# Altium schematic sheet CHM_CPU_FPGA_ADC.SchDoc: ASIM MXGS PSU Controller
size A4; Author: Andrzej Cichocki; Organization: Space Research Centre; Address1: Bartycka 18a; Address2: 00-716 Warsaw; Address3: Poland; Revision: 1; ModuleName: MainBoard Main; SubOrganization1: FPGA Space Applications Lab.
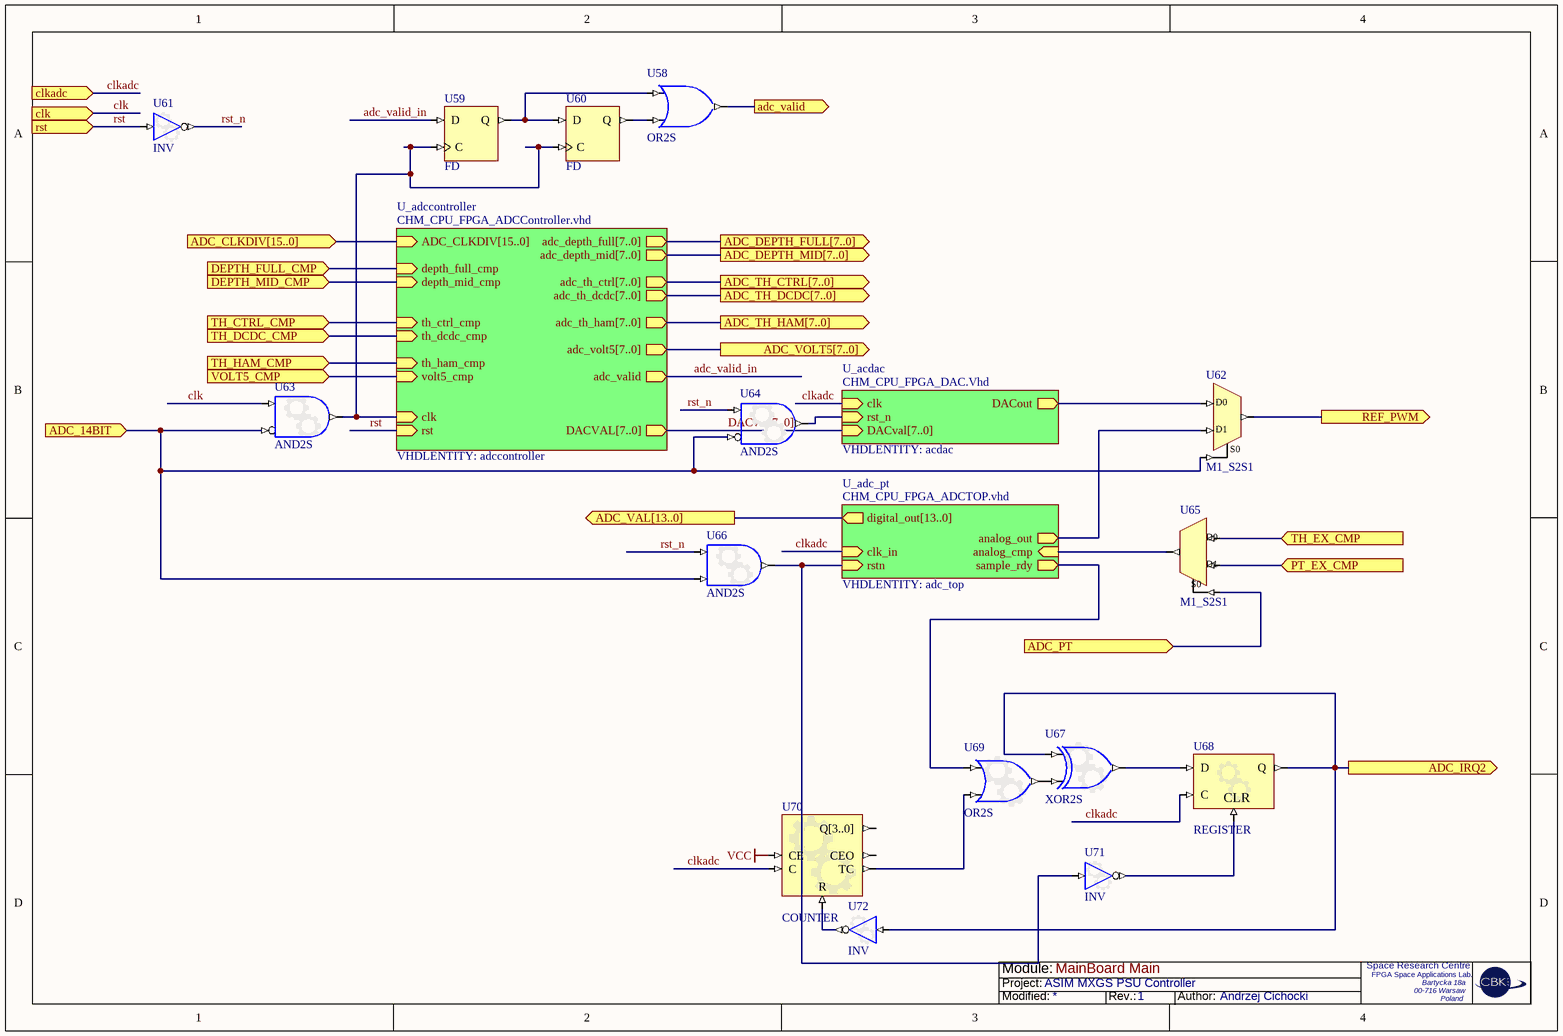
[diagram p0: CHM_CPU_FPGA_ADC.SchDoc]

## Parts
U58  OR2S
U59  FD
U60  FD
U61  INV
U62  M1_S2S1
U63  AND2S
U64  AND2S
U65  M1_S2S1
U66  AND2S
U67  XOR2S
U68  REGISTER
U69  OR2S
U70  COUNTER
U71  INV
U72  INV

## Sub-sheets
U_acdac = CHM_CPU_FPGA_DAC.Vhd: clk (in), DACout (out), rst_n (in), DACval[7..0] (in)  | VHDLENTITY: acdac
U_adc_pt = CHM_CPU_FPGA_ADCTOP.vhd: analog_cmp (in), analog_out (out), clk_in (in), rstn (in), sample_rdy (out), digital_out[13..0] (out)  | VHDLENTITY: adc_top
U_adccontroller = CHM_CPU_FPGA_ADCController.vhd: ADC_CLKDIV[15..0] (in), adc_depth_full[7..0] (out), adc_depth_mid[7..0] (out), adc_th_ctrl[7..0] (out), adc_th_dcdc[7..0] (out), adc_th_ham[7..0] (out), adc_valid (out), adc_volt5[7..0] (out), clk (in), depth_full_cmp (in), depth_mid_cmp (in), rst (in), th_ctrl_cmp (in), th_dcdc_cmp (in), th_ham_cmp (in), volt5_cmp (in), DACVAL[7..0] (out)  | VHDLENTITY: adccontroller

## Ports
ADC_14BIT (in), ADC_CLKDIV[15..0] (in), ADC_DEPTH_FULL[7..0] (out), ADC_DEPTH_MID[7..0] (out), ADC_IRQ2 (out), ADC_PT (in), ADC_TH_CTRL[7..0] (out), ADC_TH_DCDC[7..0] (out), ADC_TH_HAM[7..0] (out), ADC_VAL[13..0] (out), adc_valid (out), ADC_VOLT5[7..0] (out), clk (in), clkadc (in), DEPTH_FULL_CMP (in), DEPTH_MID_CMP (in), PT_EX_CMP (in), REF_PWM (out), rst (in), TH_CTRL_CMP (in), TH_DCDC_CMP (in), TH_EX_CMP (in), TH_HAM_CMP (in), VOLT5_CMP (in)

## Nets
VCC: U70.CE
ADC_14BIT: U62.S0 U63.I1 U64.I1 U66.I1 ; port ADC_14BIT
ADC_IRQ2: U67.I0 U68.Q U72.I ; port ADC_IRQ2
ADC_PT: U65.S0 ; port ADC_PT
adc_valid: U58.O ; port adc_valid
adc_valid_in: U59.D ; sheet U_adccontroller/adc_valid
clk: U63.I0 ; port clk
clkadc: U68.C U70.C ; port clkadc, sheet U_acdac/clk, sheet U_adc_pt/clk_in
DEPTH_FULL_CMP: port DEPTH_FULL_CMP, sheet U_adccontroller/depth_full_cmp
DEPTH_MID_CMP: port DEPTH_MID_CMP, sheet U_adccontroller/depth_mid_cmp
PT_EX_CMP: U65.D1 ; port PT_EX_CMP
REF_PWM: U62.O ; port REF_PWM
rst: U61.I ; port rst, sheet U_adccontroller/rst
rst_n: U61.O U64.I0 U66.I0
TH_CTRL_CMP: port TH_CTRL_CMP, sheet U_adccontroller/th_ctrl_cmp
TH_DCDC_CMP: port TH_DCDC_CMP, sheet U_adccontroller/th_dcdc_cmp
TH_EX_CMP: U65.D0 ; port TH_EX_CMP
TH_HAM_CMP: port TH_HAM_CMP, sheet U_adccontroller/th_ham_cmp
VOLT5_CMP: port VOLT5_CMP, sheet U_adccontroller/volt5_cmp
NetU58_I0: U58.I0 U59.Q U60.D
NetU58_I1: U58.I1 U60.Q
NetU59_C: U59.C U60.C U63.O ; sheet U_adccontroller/clk
NetU62_D0: U62.D0 ; sheet U_acdac/DACout
NetU62_D1: U62.D1 ; sheet U_adc_pt/analog_out
NetU64_O: U64.O ; sheet U_acdac/rst_n
NetU65_O: U65.O ; sheet U_adc_pt/analog_cmp
NetU66_O: U66.O U71.I ; sheet U_adc_pt/rstn
NetU67_I1: U67.I1 U69.O
NetU67_O: U67.O U68.D
NetU68_CLR: U68.CLR U71.O
NetU69_I0: U69.I0 ; sheet U_adc_pt/sample_rdy
NetU69_I1: U69.I1 U70.TC
NetU70_R: U70.R U72.O

Not connected (* = marked no-connect by the designer): U70 CEO Q[3..0]

## Buses and harness runs
bus DACval[7..0] = sheet U_acdac/DACval[7..0] = sheet U_adccontroller/DACVAL[7..0]
bus port ADC_CLKDIV[15..0] = sheet U_adccontroller/ADC_CLKDIV[15..0]
bus port ADC_DEPTH_FULL[7..0] = sheet U_adccontroller/adc_depth_full[7..0]
bus port ADC_DEPTH_MID[7..0] = sheet U_adccontroller/adc_depth_mid[7..0]
bus port ADC_TH_CTRL[7..0] = sheet U_adccontroller/adc_th_ctrl[7..0]
bus port ADC_TH_DCDC[7..0] = sheet U_adccontroller/adc_th_dcdc[7..0]
bus port ADC_TH_HAM[7..0] = sheet U_adccontroller/adc_th_ham[7..0]
bus port ADC_VAL[13..0] = sheet U_adc_pt/digital_out[13..0]
bus port ADC_VOLT5[7..0] = sheet U_adccontroller/adc_volt5[7..0]

## Notes on the sheet
- Module:
- Project:
- Modified:
- Rev.:
- Author:

## Library data of the parts
U58 = OR2S: 2-Input OR Gate, Single Pin Version; XilinxEquivalent: OR2; FunctionalClass: Logic Primitive; PortSize: 2; ArchiveName: GENERIC; VHDLIB_SIM: GENERIC_LIB; Published: 29-Jan-2004; Publisher: Altium Limited; LastRevisionNo: 1.00.00; HelpURL: CR0118 FPGA Generic Library Guide.pdf#page=410; ComponentLink1URL: CR0136 FPGA Logic Primitive Resource Usage.pdf#page=190; ComponentLink1Description: Core &Resource Usage; SubClass: OR; PortStyle: Single Pin Version
U59 U60 = FD: D-Type Flip-Flop; ClockTrigger: Rising; ArchiveName: GENERIC; VHDLIB_SIM: GENERIC_LIB; Published: 29-Jan-2004; Publisher: Altium Limited; XilinxEquivalent: FD; LastRevisionNo: 1.00.00; HelpURL: CR0118 FPGA Generic Library Guide.pdf#page=170; ComponentLink1URL: CR0133 FPGA Flip Flop Resource Usage.pdf#page=4; ComponentLink1Description: Core &Resource Usage; FunctionalClass: Flip-Flop; SubClass: FD
U61 U71 U72 = INV: Configurable Inverter; ConfigurationParameters: {}Version[1.1]{}SignalCount[1]{}SignalWidth0[1]{}OutputOption0[Inverted]{}EnableMode[None]{}ShowPinNames[False]{}; ConfiguratorName: GENERIC_BUFFER; LastRevisionNo: 1.00.00; Published: 10-Oct-2008; Publisher: Altium Limited; HelpURL: https://wiki.altium.com/display/ADOH/Configurable+Generic+Library
U62 U65 = M1_S2S1: 2x1-Single Wire to 1x1-Single Wire Multiplexer; XilinxEquivalent: M2_1; SubClass: SnS1; PortSize: 1; PortStyle: Single Pin Version; ArchiveName: GENERIC; VHDLIB_SIM: GENERIC_LIB; Published: 29-Jan-2004; Publisher: Altium Limited; LastRevisionNo: 1.00.00; HelpURL: CR0118 FPGA Generic Library Guide.pdf#page=364; ComponentLink1URL: CR0137 FPGA Multiplexer Resource Usage.pdf#page=50; ComponentLink1Description: Core &Resource Usage; FunctionalClass: Multiplexer
U63 U64 = GATE: Configurable Generic Gate; ConfiguratorName: GENERIC_GATE; ConfigurationParameters: {}Version[1.1]{}GateKind[AND]{}BusInput[False]{}GateInputType[Bit]{}GateOutputOption[Normal]{}BusWidth[8]{}RegisterOutputs[False]{}NegativeClockEdge[False]{}InputCount[2]{}InputInvert0[False]{}InputInvert1[True]{}; LastRevisionNo: 1.00.00; Published: 3-Sep-2008; Publisher: Altium Limited; HelpURL: https://wiki.altium.com/display/ADOH/Configurable+Generic+Library
U66 = GATE: Configurable Generic Gate; ConfiguratorName: GENERIC_GATE; ConfigurationParameters: {}Version[1.1]{}GateKind[AND]{}BusInput[False]{}GateInputType[Bit]{}GateOutputOption[Normal]{}BusWidth[8]{}RegisterOutputs[False]{}NegativeClockEdge[False]{}InputCount[2]{}InputInvert0[False]{}InputInvert1[False]{}; LastRevisionNo: 1.00.00; Published: 3-Sep-2008; Publisher: Altium Limited; HelpURL: https://wiki.altium.com/display/ADOH/Configurable+Generic+Library
U67 = GATE: Configurable Generic Gate; ConfiguratorName: GENERIC_GATE; ConfigurationParameters: {}Version[1.1]{}GateKind[XOR]{}BusInput[False]{}GateInputType[Bit]{}GateOutputOption[Normal]{}BusWidth[8]{}RegisterOutputs[False]{}NegativeClockEdge[False]{}InputCount[2]{}InputInvert0[False]{}InputInvert1[False]{}; LastRevisionNo: 1.00.00; Published: 3-Sep-2008; Publisher: Altium Limited; HelpURL: https://wiki.altium.com/display/ADOH/Configurable+Generic+Library
U68 = REGISTER: Configurable Register; ConfiguratorName: GENERIC_REGISTER; ConfigurationParameters: {}Version[1.1]{}RegisterType[DFlipFlop]{}NegativeTrigger[False]{}TriggerEnable[False]{}ResetMode[Asynchronous]{}SetMode[None]{}SignalCount[1]{}SignalWidth0[1]{}OutputOption0[Normal]{}; LastRevisionNo: 1.00.00; Published: 13-Oct-2008; Publisher: Altium Limited; HelpURL: https://wiki.altium.com/display/ADOH/Configurable+Generic+Library
U69 = GATE: Configurable Generic Gate; ConfiguratorName: GENERIC_GATE; ConfigurationParameters: {}Version[1.1]{}GateKind[OR]{}BusInput[False]{}GateInputType[Bit]{}GateOutputOption[Normal]{}BusWidth[8]{}RegisterOutputs[False]{}NegativeClockEdge[False]{}InputCount[2]{}InputInvert0[False]{}InputInvert1[False]{}; LastRevisionNo: 1.00.00; Published: 3-Sep-2008; Publisher: Altium Limited; HelpURL: https://wiki.altium.com/display/ADOH/Configurable+Generic+Library
U70 = COUNTER: Configurable Counter; ConfiguratorName: GENERIC_COUNTER; ConfigurationParameters: {}Version[1.0]{}Type[Binary]{}SyncReset[True]{}NegativeClockEdge[False]{}FixedDirection[True]{}IsIncrement[True]{}SignalWidth[4]{}MaxValue[15]{}BusOutput[True]{}Loadable[False]{}BusInput[False]{}; LastRevisionNo: 1.00.00; Published: 14-Jan-2009; Publisher: Altium Limited